# Altium schematic sheet AFC01-S14FCA-001_AFC01-S14FCA-00.schdoc
size 124 x 99 mm
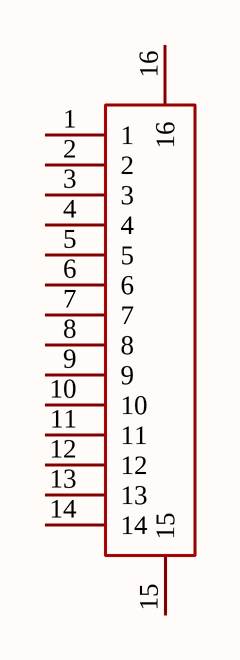
[diagram p0: AFC01-S14FCA-001_AFC01-S14FCA-00.schdoc]

## Parts
X?  AFC01-S14FCA-00  [FPC-SMD_AFC01-S14FCA-00]  (value not drawn)

## Nets

Not connected (* = marked no-connect by the designer): X? 1 2 3 4 5 6 7 8 9 10 11 12 13 14 15 16

## Library data of the parts
X? = AFC01-S14FCA-00: Manufacturer: JS(钜硕电子); Add into BOM: yes; Locking Feature: 翻盖式; Number of Contacts: 14P; Pitch: 0.5mm; FFC, FCB Thickness: 0.3mm; Symbol: AFC01-S14FCA-00; Device: AFC01-S14FCA-00; LCSC Part Name: 间距:0.5mm P数:14P 翻盖式 下接; Supplier Part: C262663; Manufacturer Part: AFC01-S14FCA-00; Supplier Footprint: SMD,P=0.5mm,卧贴; JLCPCB Part Class: Extended Part; Datasheet: https://atta.szlcsc.com/upload/public/pdf/source/20190816/C413942_2A72D1AC756EAE17EEDF756A339D4500.pdf; Supplier: LCSC; Convert to PCB: yes; Contact Type: 下接; Mounting Type: 卧贴; Height Above Board: 2mm; Operating Temperature Range: -